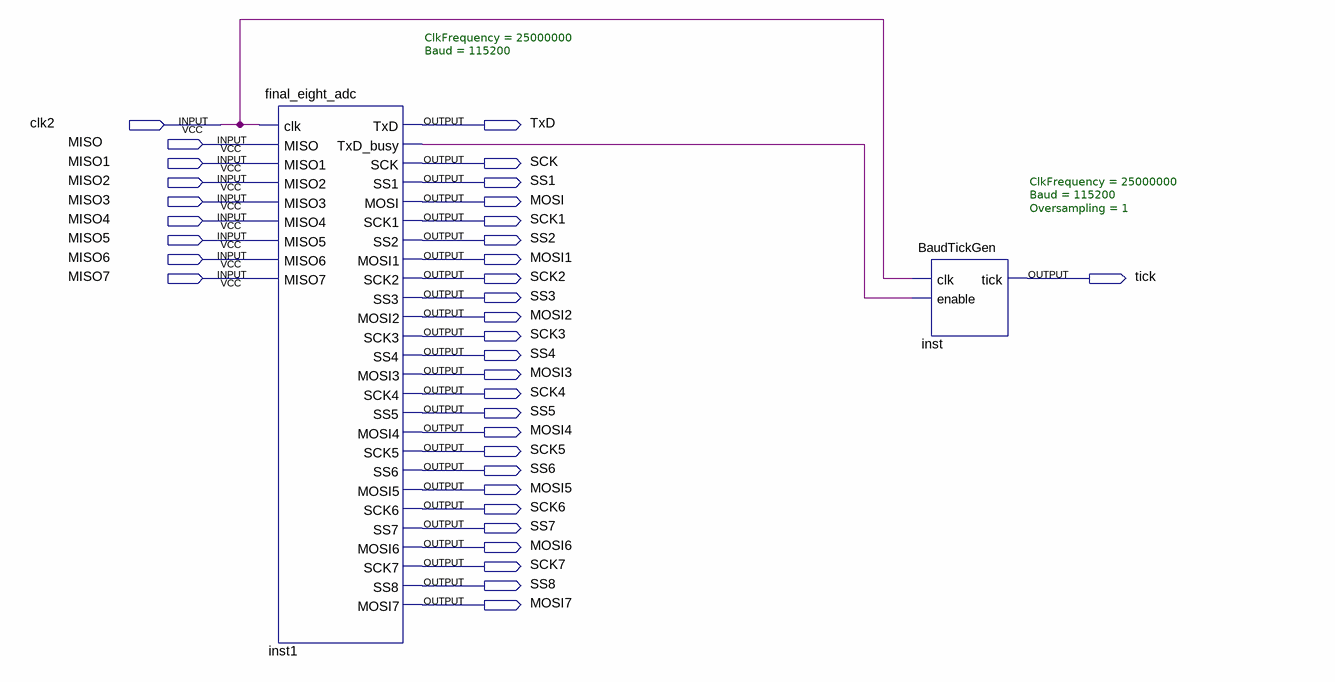
[diagram p0: schematic sheet]
// Quartus schematic Block1.bdf as structural Verilog: 2 symbols, 35 pins
module Block1 (
  input  clk2,
  input  MISO,
  input  MISO1,
  input  MISO2,
  input  MISO3,
  input  MISO4,
  input  MISO5,
  input  MISO6,
  input  MISO7,
  output TxD,
  output SCK,
  output SS1,
  output MOSI,
  output SCK1,
  output SS2,
  output MOSI1,
  output SCK2,
  output tick,
  output SS3,
  output MOSI2,
  output SCK3,
  output SS4,
  output MOSI3,
  output SCK4,
  output SS5,
  output MOSI4,
  output SCK5,
  output SS6,
  output MOSI5,
  output SCK6,
  output SS7,
  output MOSI6,
  output SCK7,
  output SS8,
  output MOSI7
);

  wire inst1_txd_busy;

  final_eight_adc #(.ClkFrequency(25000000), .Baud(115200)) inst1 (
    .clk(clk2), .MISO(MISO), .MISO1(MISO1), .MISO2(MISO2), .MISO3(MISO3), .MISO4(MISO4), .MISO5(MISO5),
    .MISO6(MISO6), .MISO7(MISO7), .TxD(TxD), .TxD_busy(inst1_txd_busy), .SCK(SCK), .SS1(SS1), .MOSI(MOSI),
    .SCK1(SCK1), .SS2(SS2), .MOSI1(MOSI1), .SCK2(SCK2), .SS3(SS3), .MOSI2(MOSI2), .SCK3(SCK3), .SS4(SS4),
    .MOSI3(MOSI3), .SCK4(SCK4), .SS5(SS5), .MOSI4(MOSI4), .SCK5(SCK5), .SS6(SS6), .MOSI5(MOSI5), .SCK6(SCK6),
    .SS7(SS7), .MOSI6(MOSI6), .SCK7(SCK7), .SS8(SS8), .MOSI7(MOSI7));
  BaudTickGen #(.ClkFrequency(25000000), .Baud(115200), .Oversampling(1)) inst (
    .clk(clk2), .enable(inst1_txd_busy), .tick(tick));
endmodule
